# Altium schematic sheet ARDUINO_DUE_EXT_2021-11-28.schdoc
size 156 x 81 mm
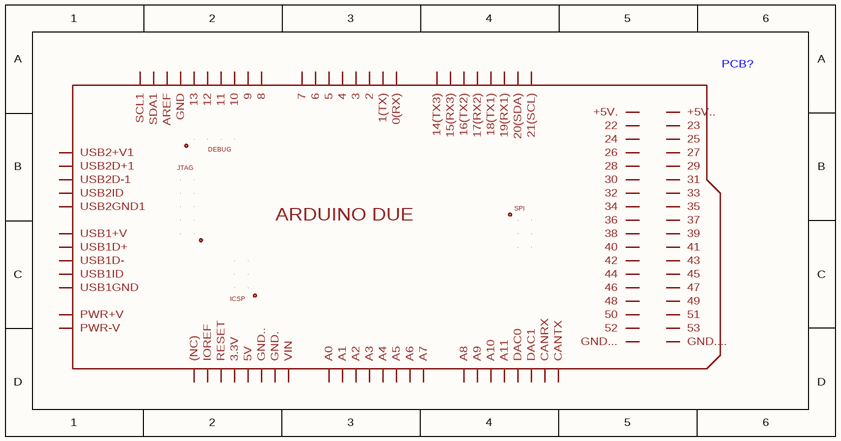
[diagram p0: ARDUINO_DUE_EXT_2021-11-28.schdoc]

## Parts
PCB?  (no value)  [ARDUINO-DUE-EXT]

## Nets

Not connected (* = marked no-connect by the designer): PCB? ?1(SCL1) ?2(SDA1) ?3(AREF) ?4(GND) ?5(13) ?6(12) ?7(11) ?8(10) ?9(9) ?10(8) ?11(7) ?12(6) ?13(5) ?14(4) ?15(3) ?16(2) ?17(1(TX)) ?18(0(RX)) ?19(A5) ?20(A4) ?21(A3) ?22(A2) ?23(A1) ?24(A0) ?25(VIN) ?26(GND.) ?27(GND..) ?28(5V) ?29(3.3V) ?30(RESET) ?31(IOREF) ?32((NC)) ?33(PWR-V) ?34(PWR+V) ?35(USB1GND) ?36(USB1D-) ?37(USB1D+) ?38(USB1+V) ?39(+5V) ?40(MOSI2) ?41(GND_) ?42(RESET2) ?43(SCK2) ?44(MISO2) ?45(USB2GND1) ?46(USB2D-1) ?47(USB2D+1) ?48(USB2+V1) ?49(14(TX3)) ?50(15(RX3)) ?51(16(TX2)) ?52(17(RX2)) ?53(18(TX1)) ?54(19(RX1)) ?55(20(SDA)) ?56(21(SCL)) ?57(CANTX) ?58(CANRX) ?59(DAC1) ?60(DAC0) ?61(A11) ?62(A10) ?63(A9) ?64(A8) ?65(A6) ?66(A7) ?67(+5V..) ?68(23) ?69(25) ?70(27) ?71(29) ?72(31) ?73(33) ?74(35) ?75(37) ?76(39) ?77(41) ?78(43) ?79(45) ?80(47) ?81(49) ?82(51) ?83(53) ?84(GND....) ?85(GND...) ?86(52) ?87(50) ?88(48) ?89(46) ?90(44) ?91(42) ?92(40) ?93(38) ?94(36) ?95(34) ?96(32) ?97(30) ?98(28) ?99(26) ?100(24) ?101(22) ?102(+5V.) ?103(+5V_) ?104(MOSI) ?105(GND__) ?106(RESET.) ?107(SCK) ?108(MISO) ?109(RESET..) ?110(SWDIO) ?111(SWCLK) ?112(GND1) ?113(TDI) ?114(TDO) ?115(TCK) ?116(TMS) ?117(RESET_) ?118(GND1...) ?119(NC.) ?120(GND1..) ?121(GND1.) ?122(+3.3V) ?123(USB2ID) ?124(USB1ID)

## Notes on the sheet
- (in symbol ARDUINO_DUE_EXT) DEBUG; JTAG; SPI; ARDUINO DUE; ICSP

## Library data of the parts
PCB? = ARDUINO_DUE_EXT